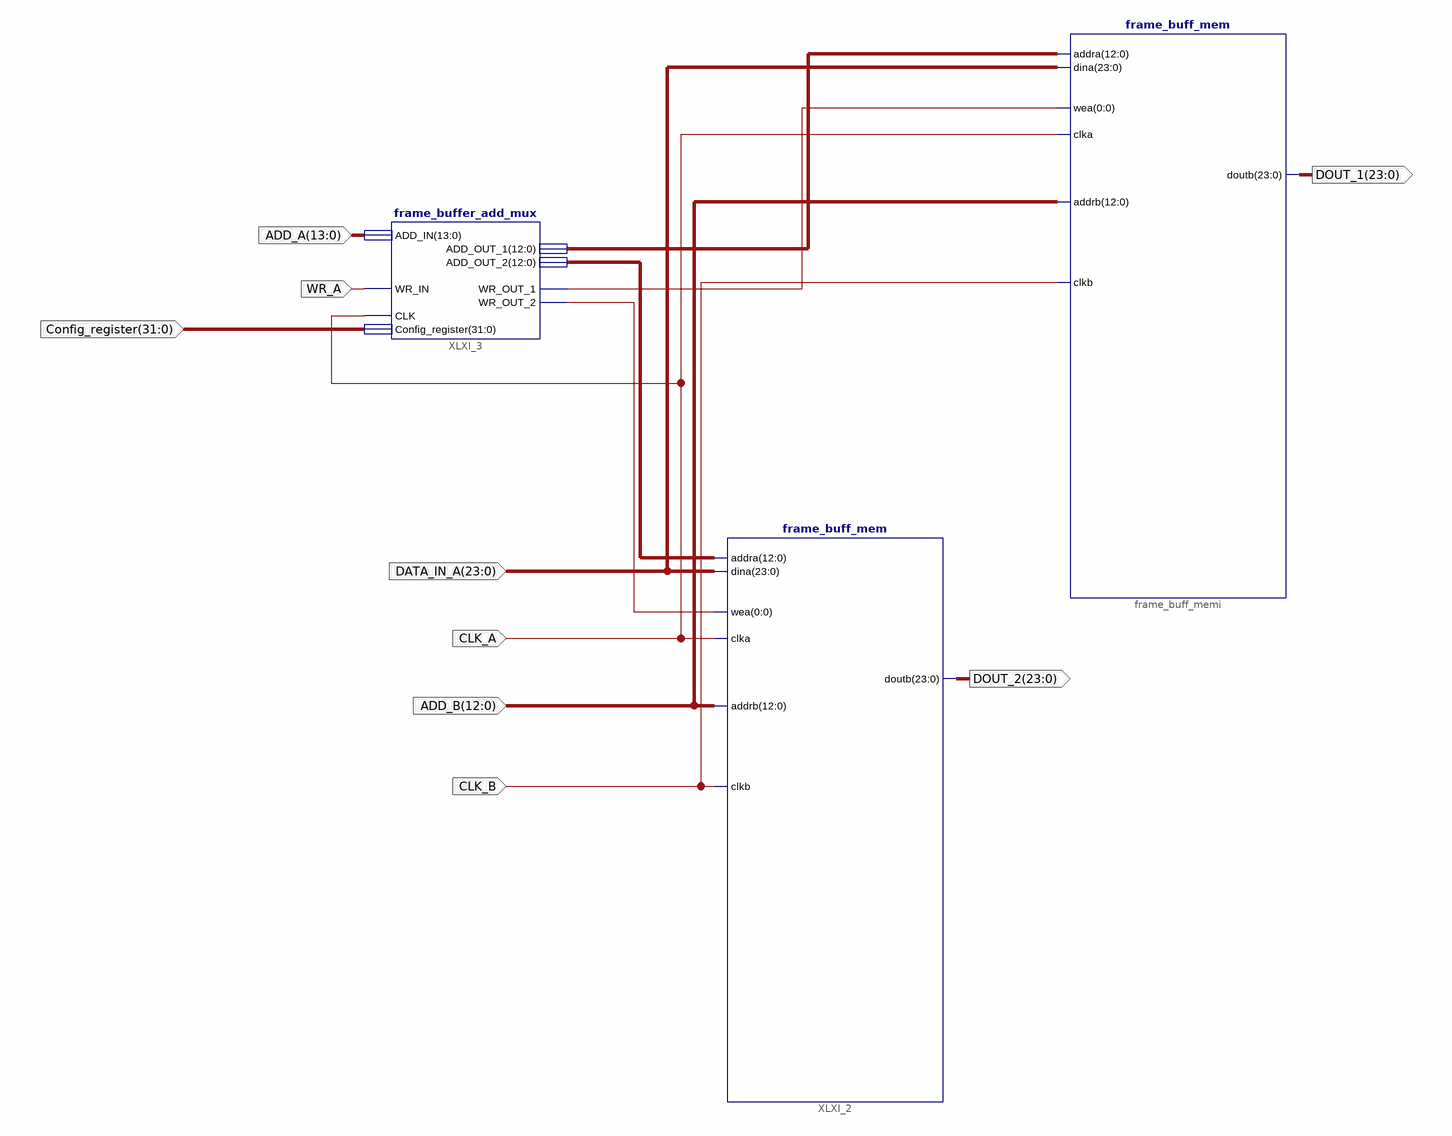
[diagram p0: schematic sheet 1]
// Xilinx ISE schematic sch_frame_buffer.sch (spartan6) as structural Verilog: 3 symbols, 9 ports
module sch_frame_buffer (
  input  [23:0] DATA_IN_A,
  input  CLK_A,
  input  [12:0] ADD_B,
  input  CLK_B,
  input  WR_A,
  input  [13:0] ADD_A,
  input  [31:0] Config_register,
  output [23:0] DOUT_1,
  output [23:0] DOUT_2
);

  wire [0:0] XLXN_16, XLXN_18;
  wire [12:0] XLXN_15, XLXN_17;

  frame_buff_mem frame_buff_memi (
    .addra(XLXN_15), .dina(DATA_IN_A), .wea(XLXN_16[0]), .clka(CLK_A), .addrb(ADD_B), .clkb(CLK_B),
    .doutb(DOUT_1));
  frame_buff_mem XLXI_2 (
    .addra(XLXN_17), .dina(DATA_IN_A), .wea(XLXN_18[0]), .clka(CLK_A), .addrb(ADD_B), .clkb(CLK_B),
    .doutb(DOUT_2));
  frame_buffer_add_mux XLXI_3 (
    .WR_IN(WR_A), .ADD_IN(ADD_A), .WR_OUT_1(XLXN_16[0]), .WR_OUT_2(XLXN_18[0]), .ADD_OUT_1(XLXN_15),
    .ADD_OUT_2(XLXN_17), .CLK(CLK_A), .Config_register(Config_register));
endmodule
